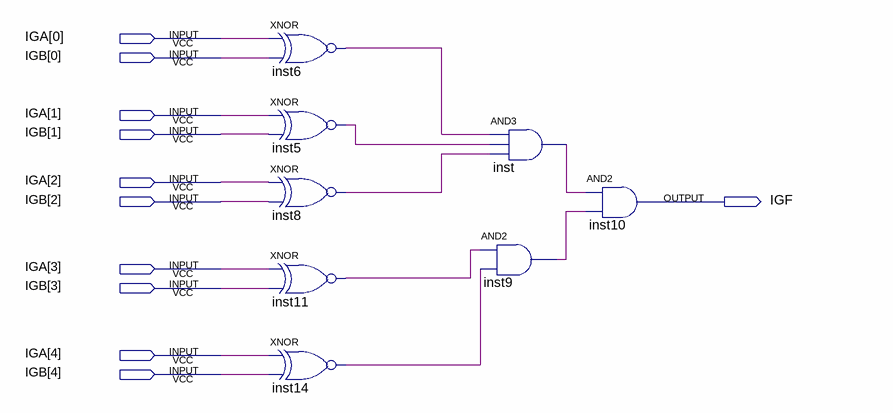
[diagram p0: schematic sheet]
// Quartus schematic Igualdade.bdf as structural Verilog: 8 symbols, 11 pins
module Igualdade (
  input  [4:0] IGA,
  input  [4:0] IGB,
  output IGF
);

  wire inst5_out, inst6_out, inst8_out, inst9_out, inst11_out, inst14_out, inst_out;

  xnor inst6 (inst6_out, IGA[0], IGB[0]);
  xnor inst5 (inst5_out, IGA[1], IGB[1]);
  xnor inst8 (inst8_out, IGA[2], IGB[2]);
  xnor inst11 (inst11_out, IGA[3], IGB[3]);
  xnor inst14 (inst14_out, IGA[4], IGB[4]);
  and inst (inst_out, inst6_out, inst5_out, inst8_out);
  and inst9 (inst9_out, inst11_out, inst14_out);
  and inst10 (IGF, inst_out, inst9_out);
endmodule
